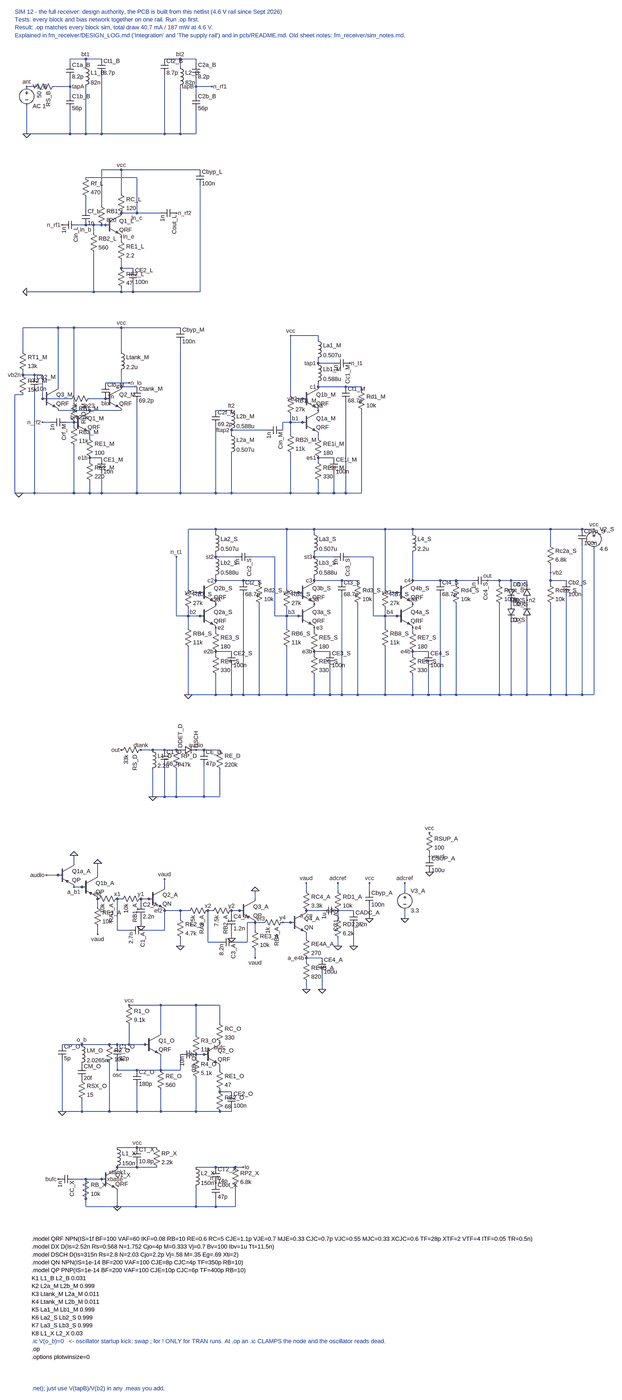
[diagram p0: schematic sim12_full_receiver.asc, whole sheet]
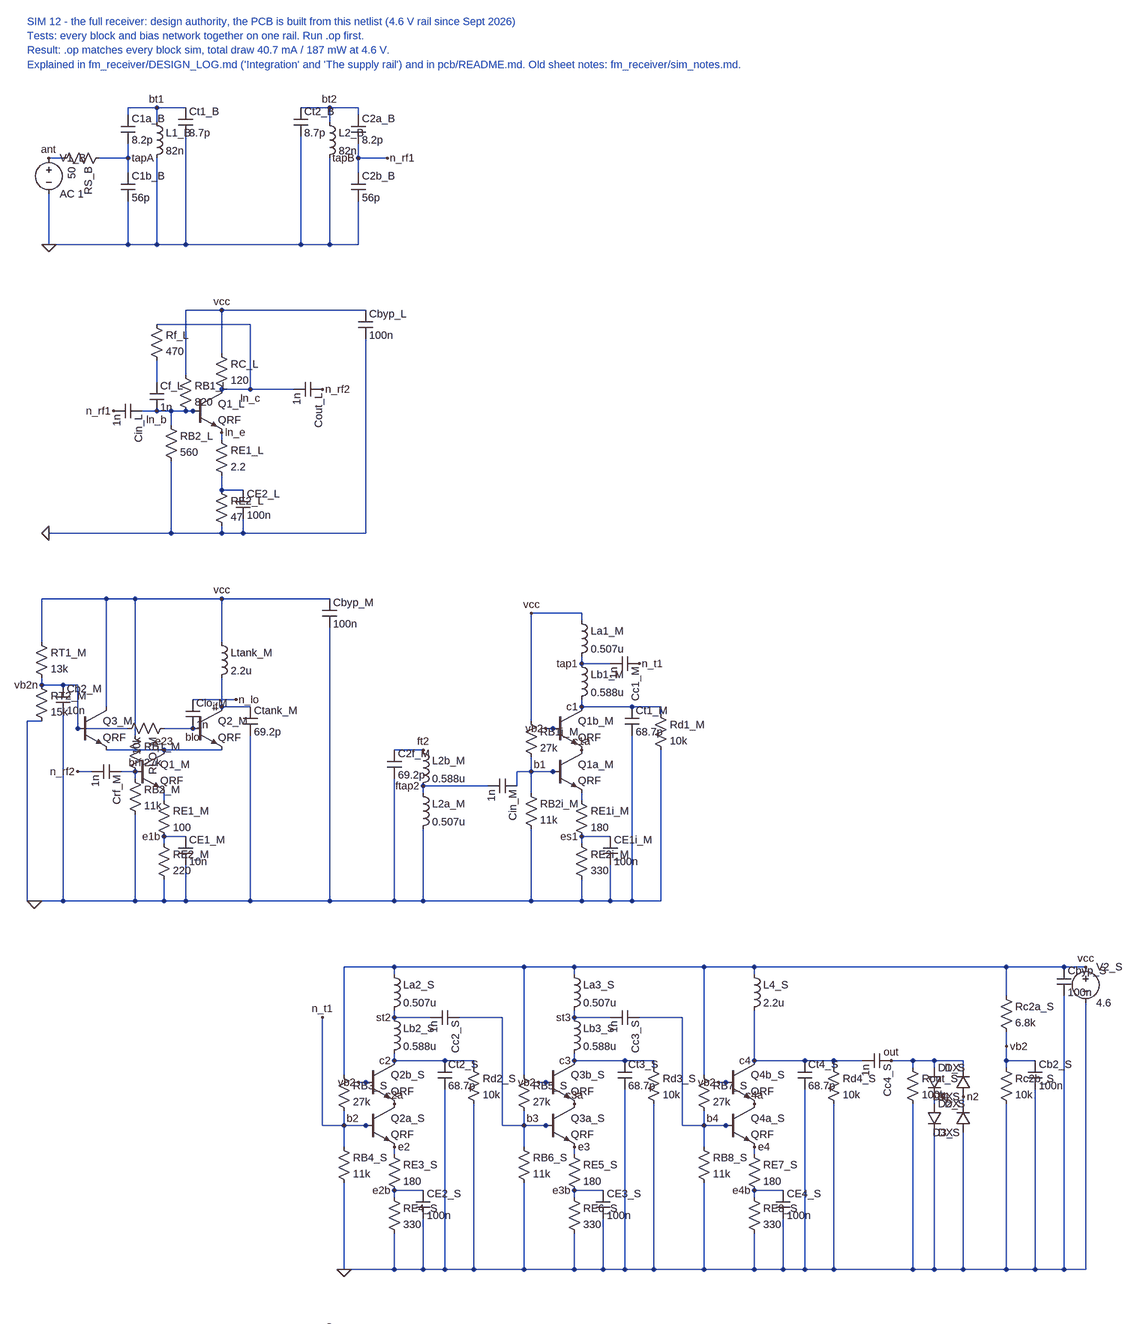
[diagram p1: schematic sim12_full_receiver.asc, part, row 1 of 2, column 1 of 1]
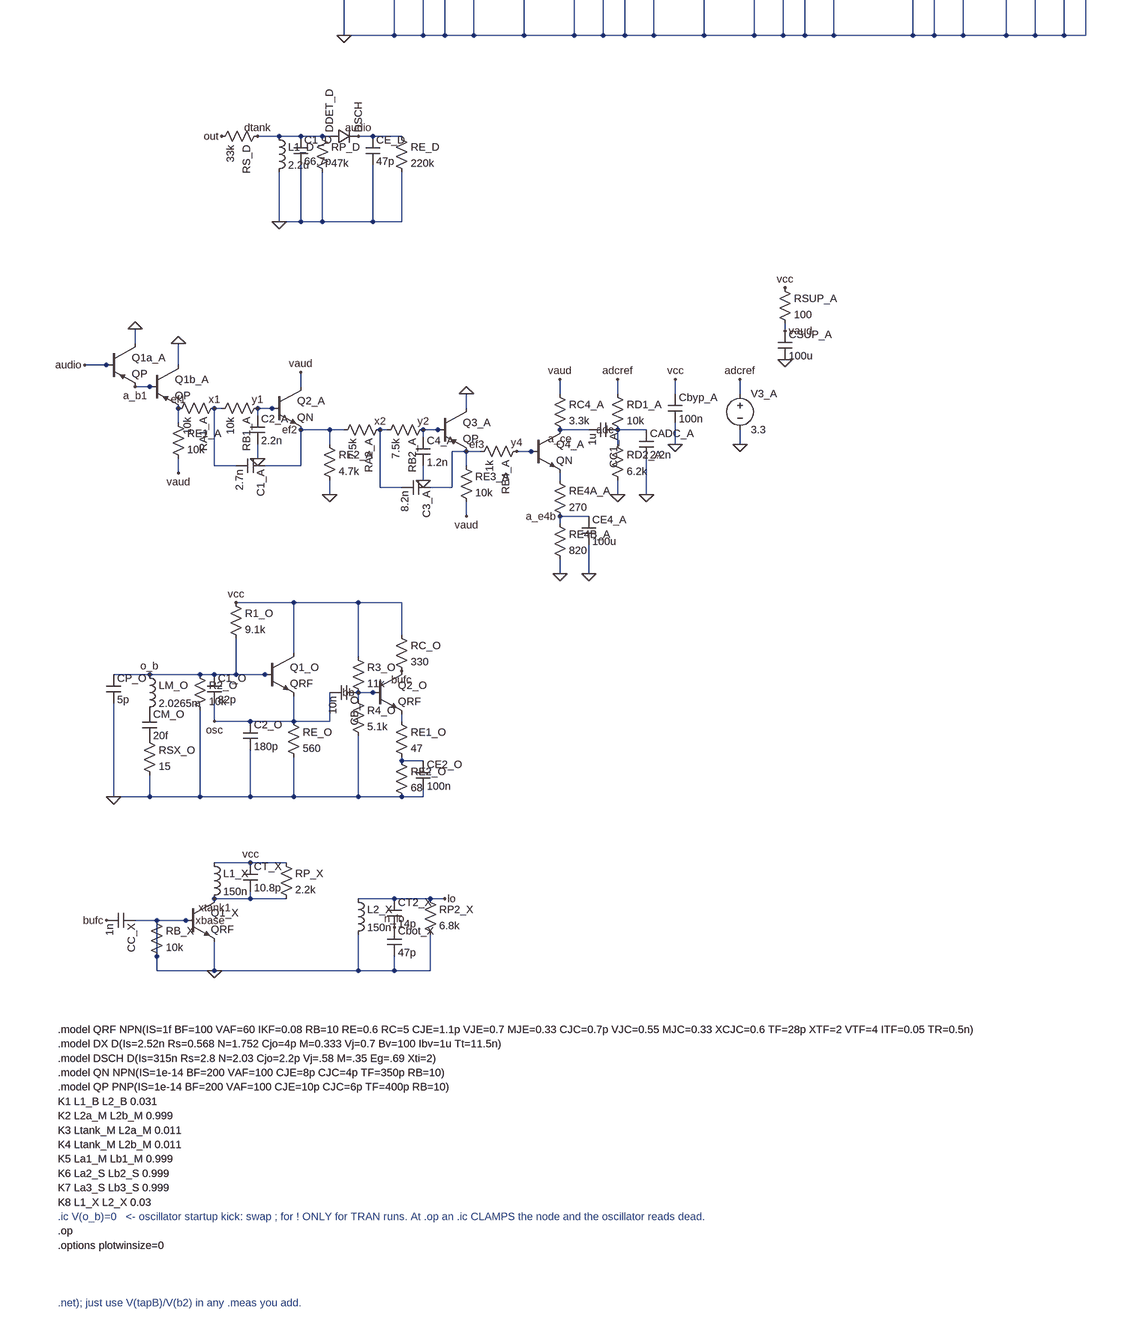
[diagram p2: schematic sim12_full_receiver.asc, part, row 2 of 2, column 1 of 1]
sim12_full_receiver.asc, the LTspice schematic file:
Version 4
SHEET 1 4000 7400
WIRE 80 208 112 208
WIRE 192 208 256 208
WIRE 80 288 80 400
WIRE 256 96 320 96
WIRE 320 96 384 96
WIRE 256 96 256 112
WIRE 256 176 256 240
WIRE 256 304 256 400
WIRE 320 96 320 128
WIRE 320 208 320 400
WIRE 384 160 384 400
WIRE 640 96 704 96
WIRE 704 96 768 96
WIRE 640 160 640 400
WIRE 704 96 704 128
WIRE 704 208 704 400
WIRE 768 96 768 112
WIRE 768 176 768 240
WIRE 768 304 768 400
WIRE 768 208 832 208
WIRE 80 400 256 400
WIRE 256 400 320 400
WIRE 320 400 384 400
WIRE 384 400 640 400
WIRE 640 400 704 400
WIRE 704 400 768 400
FLAG 80 400 0
FLAG 80 208 ant
FLAG 256 208 tapA
FLAG 320 96 bt1
FLAG 704 96 bt2
FLAG 768 208 tapB
FLAG 832 208 n_rf1
SYMBOL voltage 80 192 R0
SYMATTR InstName V1_B
SYMATTR Value AC 1
SYMBOL res 208 192 R90
SYMATTR InstName RS_B
SYMATTR Value 50
SYMBOL cap 240 112 R0
SYMATTR InstName C1a_B
SYMATTR Value 8.2p
SYMBOL cap 240 240 R0
SYMATTR InstName C1b_B
SYMATTR Value 56p
SYMBOL ind 304 112 R0
SYMATTR InstName L1_B
SYMATTR Value 82n
SYMATTR SpiceLine Rser=0.47
SYMBOL cap 368 96 R0
SYMATTR InstName Ct1_B
SYMATTR Value 8.7p
SYMBOL cap 624 96 R0
SYMATTR InstName Ct2_B
SYMATTR Value 8.7p
SYMBOL ind 688 112 R0
SYMATTR InstName L2_B
SYMATTR Value 82n
SYMATTR SpiceLine Rser=0.47
SYMBOL cap 752 112 R0
SYMATTR InstName C2a_B
SYMATTR Value 8.2p
SYMBOL cap 752 240 R0
SYMATTR InstName C2b_B
SYMATTR Value 56p
WIRE 288 1040 320 1040
WIRE 320 1040 352 1040
WIRE 352 1040 384 1040
WIRE 384 1040 416 1040
WIRE 320 928 320 976
WIRE 320 848 528 848
WIRE 352 1040 352 1072
WIRE 352 1152 352 1312
WIRE 384 816 384 960
WIRE 464 912 464 816
WIRE 464 992 528 992
WIRE 528 848 528 992
WIRE 528 992 624 992
WIRE 464 1088 464 1104
WIRE 464 1184 464 1216
WIRE 464 1216 512 1216
WIRE 512 1280 512 1312
WIRE 464 1296 464 1312
WIRE 384 816 464 816
WIRE 464 816 784 816
WIRE 784 880 784 1312
WIRE 80 1312 352 1312
WIRE 352 1312 464 1312
WIRE 464 1312 512 1312
WIRE 512 1312 688 1312
WIRE 688 1312 784 1312
FLAG 80 1312 0
FLAG 464 816 vcc
FLAG 224 1040 n_rf1
FLAG 320 1040 ln_b
FLAG 528 992 ln_c
FLAG 688 992 n_rf2
FLAG 464 1088 ln_e
SYMBOL cap 288 1024 R90
SYMATTR InstName Cin_L
SYMATTR Value 1n
SYMBOL res 304 832 R0
SYMATTR InstName Rf_L
SYMATTR Value 470
SYMBOL cap 304 976 R0
SYMATTR InstName Cf_L
SYMATTR Value 1n
SYMBOL res 368 944 R0
SYMATTR InstName RB1_L
SYMATTR Value 820
SYMBOL res 336 1056 R0
SYMATTR InstName RB2_L
SYMATTR Value 560
SYMBOL npn 400 992 R0
SYMATTR InstName Q1_L
SYMATTR Value QRF
SYMBOL res 448 896 R0
SYMATTR InstName RC_L
SYMATTR Value 120
SYMBOL res 448 1088 R0
SYMATTR InstName RE1_L
SYMATTR Value 2.2
SYMBOL res 448 1200 R0
SYMATTR InstName RE2_L
SYMATTR Value 47
SYMBOL cap 496 1216 R0
SYMATTR InstName CE2_L
SYMATTR Value 100n
SYMBOL cap 688 976 R90
SYMATTR InstName Cout_L
SYMATTR Value 1n
SYMBOL cap 768 816 R0
SYMATTR InstName Cbyp_L
SYMATTR Value 100n
WIRE 64 1616 208 1616
WIRE 208 1616 272 1616
WIRE 272 1616 464 1616
WIRE 464 1616 704 1616
WIRE 64 1712 64 1616
WIRE 208 1856 208 1616
WIRE 272 1920 272 1616
WIRE 464 1712 464 1616
WIRE 64 1792 64 1808
WIRE 64 1888 32 1888
WIRE 32 1888 32 2288
WIRE 32 2288 48 2288
WIRE 64 1808 112 1808
WIRE 112 1808 144 1808
WIRE 144 1808 144 1904
WIRE 112 1872 112 2288
WIRE 144 1904 256 1904
WIRE 336 1904 400 1904
WIRE 400 1840 496 1840
WIRE 464 1792 464 1856
WIRE 464 1856 528 1856
WIRE 528 1920 528 2288
WIRE 208 1952 336 1952
WIRE 336 1952 464 1952
WIRE 144 2000 176 2000
WIRE 240 2000 272 2000
WIRE 272 2000 272 2016
WIRE 272 2096 272 2288
WIRE 336 2048 336 2064
WIRE 336 2144 336 2160
WIRE 336 2144 384 2144
WIRE 336 2240 336 2288
WIRE 384 2208 384 2288
WIRE 48 2288 112 2288
WIRE 112 2288 272 2288
WIRE 272 2288 336 2288
WIRE 336 2288 384 2288
WIRE 384 2288 528 2288
WIRE 528 2288 640 2288
WIRE 640 2288 704 2288
WIRE 704 1680 704 2288
WIRE 704 2288 768 2288
WIRE 848 1952 912 1952
WIRE 848 2016 848 2288
WIRE 912 2032 912 2048
WIRE 912 2032 1056 2032
WIRE 912 2128 912 2288
WIRE 1120 2000 1120 2032
WIRE 1120 2000 1152 2000
WIRE 1152 1648 1264 1648
WIRE 1152 1648 1152 1888
WIRE 1264 1648 1264 1664
WIRE 1264 1744 1264 1760
WIRE 1264 1840 1264 1856
WIRE 1264 1856 1376 1856
WIRE 1376 1856 1440 1856
WIRE 1440 1856 1440 1872
WIRE 1440 1952 1440 2288
WIRE 1376 1920 1376 2288
WIRE 1152 1968 1152 2048
WIRE 1152 2000 1216 2000
WIRE 1184 1904 1216 1904
WIRE 1152 2128 1152 2288
WIRE 1264 2048 1264 2064
WIRE 1264 2144 1264 2160
WIRE 1264 2144 1328 2144
WIRE 1264 2240 1264 2288
WIRE 1328 2208 1328 2288
WIRE 768 2288 848 2288
WIRE 848 2288 912 2288
WIRE 912 2288 1152 2288
WIRE 1152 2288 1264 2288
WIRE 1264 2288 1328 2288
WIRE 1328 2288 1376 2288
WIRE 1376 2288 1440 2288
FLAG 48 2288 0
FLAG 464 1616 vcc
FLAG 1152 1648 vcc
FLAG 272 2000 brf
FLAG 64 1808 vb2n
FLAG 400 1904 blo
FLAG 336 1952 e23
FLAG 464 1856 if
FLAG 336 2144 e1b
FLAG 912 1952 ft2
FLAG 912 2032 ftap2
FLAG 1152 2000 b1
FLAG 1184 1904 vb2
FLAG 1264 1760 tap1
FLAG 1264 1856 c1
FLAG 1264 1952 c1a
FLAG 1264 2144 es1
SYMBOL cap 240 1984 R90
SYMATTR InstName Crf_M
SYMATTR Value 1n
SYMBOL res 256 1904 R0
SYMATTR InstName RB1_M
SYMATTR Value 27k
SYMBOL res 256 2000 R0
SYMATTR InstName RB2_M
SYMATTR Value 11k
SYMBOL npn 272 1952 R0
SYMATTR InstName Q1_M
SYMATTR Value QRF
SYMBOL res 320 2048 R0
SYMATTR InstName RE1_M
SYMATTR Value 100
SYMBOL res 320 2144 R0
SYMATTR InstName RE2_M
SYMATTR Value 220
SYMBOL cap 368 2144 R0
SYMATTR InstName CE1_M
SYMATTR Value 10n
SYMBOL res 48 1696 R0
SYMATTR InstName RT1_M
SYMATTR Value 13k
SYMBOL res 48 1792 R0
SYMATTR InstName RT2_M
SYMATTR Value 15k
SYMBOL cap 96 1808 R0
SYMATTR InstName Cb2_M
SYMATTR Value 10n
SYMBOL npn 144 1856 R0
SYMATTR InstName Q3_M
SYMATTR Value QRF
SYMBOL npn 400 1856 R0
SYMATTR InstName Q2_M
SYMATTR Value QRF
SYMBOL res 352 1888 R90
SYMATTR InstName RLO_M
SYMATTR Value 10k
SYMBOL cap 384 1840 R0
SYMATTR InstName Clo_M
SYMATTR Value 1n
SYMBOL ind 448 1696 R0
SYMATTR InstName Ltank_M
SYMATTR Value 2.2u
SYMATTR SpiceLine Rser=1
SYMBOL cap 512 1856 R0
SYMATTR InstName Ctank_M
SYMATTR Value 69.2p
SYMBOL cap 688 1616 R0
SYMATTR InstName Cbyp_M
SYMATTR Value 100n
SYMBOL cap 832 1952 R0
SYMATTR InstName C2f_M
SYMATTR Value 69.2p
SYMBOL ind 896 1936 R0
SYMATTR InstName L2b_M
SYMATTR Value 0.588u
SYMATTR SpiceLine Rser=0.5
SYMBOL ind 896 2032 R0
SYMATTR InstName L2a_M
SYMATTR Value 0.507u
SYMATTR SpiceLine Rser=0.5
SYMBOL cap 1120 2016 R90
SYMATTR InstName Cin_M
SYMATTR Value 1n
SYMBOL res 1136 1872 R0
SYMATTR InstName RB1i_M
SYMATTR Value 27k
SYMBOL res 1136 2032 R0
SYMATTR InstName RB2i_M
SYMATTR Value 11k
SYMBOL npn 1200 1856 R0
SYMATTR InstName Q1b_M
SYMATTR Value QRF
SYMBOL npn 1200 1952 R0
SYMATTR InstName Q1a_M
SYMATTR Value QRF
SYMBOL ind 1248 1648 R0
SYMATTR InstName La1_M
SYMATTR Value 0.507u
SYMBOL ind 1248 1744 R0
SYMATTR InstName Lb1_M
SYMATTR Value 0.588u
SYMBOL cap 1360 1856 R0
SYMATTR InstName Ct1_M
SYMATTR Value 68.7p
SYMBOL res 1424 1856 R0
SYMATTR InstName Rd1_M
SYMATTR Value 10k
SYMBOL res 1248 2048 R0
SYMATTR InstName RE1i_M
SYMATTR Value 180
SYMBOL res 1248 2144 R0
SYMATTR InstName RE2i_M
SYMATTR Value 330
SYMBOL cap 1312 2144 R0
SYMATTR InstName CE1i_M
SYMATTR Value 100n
SYMBOL cap 1392 1744 R90
SYMATTR InstName Cc1_M
SYMATTR Value 1n
WIRE 1264 1760 1328 1760
FLAG 1392 1760 n_t1
FLAG 144 2000 n_rf2
FLAG 496 1840 n_lo
WIRE 736 2448 848 2448
WIRE 848 2448 1136 2448
WIRE 1136 2448 1248 2448
WIRE 1248 2448 1536 2448
WIRE 1536 2448 1648 2448
WIRE 1648 2448 2208 2448
WIRE 2208 2448 2336 2448
WIRE 2336 2448 2384 2448
WIRE 736 2448 736 2688
WIRE 848 2448 848 2464
WIRE 1136 2448 1136 2688
WIRE 1248 2448 1248 2464
WIRE 1536 2448 1536 2688
WIRE 1648 2448 1648 2464
WIRE 2208 2448 2208 2512
WIRE 688 2560 688 2800
WIRE 688 2800 736 2800
WIRE 736 2768 736 2848
WIRE 736 2928 736 3120
WIRE 736 2800 800 2800
WIRE 768 2704 800 2704
WIRE 848 2544 848 2560
WIRE 848 2640 848 2656
WIRE 848 2656 960 2656
WIRE 960 2656 1024 2656
WIRE 1024 2656 1024 2672
WIRE 1024 2752 1024 3120
WIRE 960 2720 960 3120
WIRE 848 2848 848 2864
WIRE 848 2944 848 2960
WIRE 848 2944 912 2944
WIRE 848 3040 848 3120
WIRE 912 3008 912 3120
WIRE 848 2560 928 2560
WIRE 992 2560 1088 2560
WIRE 1088 2560 1088 2800
WIRE 1088 2800 1136 2800
WIRE 1136 2768 1136 2848
WIRE 1136 2928 1136 3120
WIRE 1136 2800 1200 2800
WIRE 1168 2704 1200 2704
WIRE 1248 2544 1248 2560
WIRE 1248 2640 1248 2656
WIRE 1248 2656 1360 2656
WIRE 1360 2656 1424 2656
WIRE 1424 2656 1424 2672
WIRE 1424 2752 1424 3120
WIRE 1360 2720 1360 3120
WIRE 1248 2848 1248 2864
WIRE 1248 2944 1248 2960
WIRE 1248 2944 1312 2944
WIRE 1248 3040 1248 3120
WIRE 1312 3008 1312 3120
WIRE 1248 2560 1328 2560
WIRE 1392 2560 1488 2560
WIRE 1488 2560 1488 2800
WIRE 1488 2800 1536 2800
WIRE 1536 2768 1536 2848
WIRE 1536 2928 1536 3120
WIRE 1536 2800 1600 2800
WIRE 1568 2704 1600 2704
WIRE 1648 2544 1648 2656
WIRE 1648 2656 1760 2656
WIRE 1760 2656 1824 2656
WIRE 1824 2656 1824 2672
WIRE 1824 2752 1824 3120
WIRE 1760 2720 1760 3120
WIRE 1648 2848 1648 2864
WIRE 1648 2944 1648 2960
WIRE 1648 2944 1712 2944
WIRE 1648 3040 1648 3120
WIRE 1712 3008 1712 3120
WIRE 1824 2656 1888 2656
WIRE 1952 2656 2000 2656
WIRE 2000 2656 2048 2656
WIRE 2048 2656 2112 2656
WIRE 2000 2656 2000 2672
WIRE 2000 2752 2000 3120
WIRE 2048 2656 2048 2672
WIRE 2048 2736 2048 2752
WIRE 2048 2816 2048 3120
WIRE 2112 2656 2112 2672
WIRE 2112 2752 2112 2736
WIRE 2112 2816 2112 3120
WIRE 2208 2592 2208 2672
WIRE 2208 2656 2272 2656
WIRE 2208 2752 2208 3120
WIRE 2272 2720 2272 3120
WIRE 2336 2512 2336 3120
WIRE 2384 2528 2384 3120
WIRE 736 3120 848 3120
WIRE 848 3120 912 3120
WIRE 912 3120 960 3120
WIRE 960 3120 1024 3120
WIRE 1024 3120 1136 3120
WIRE 1136 3120 1248 3120
WIRE 1248 3120 1312 3120
WIRE 1312 3120 1360 3120
WIRE 1360 3120 1424 3120
WIRE 1424 3120 1536 3120
WIRE 1536 3120 1648 3120
WIRE 1648 3120 1712 3120
WIRE 1712 3120 1760 3120
WIRE 1760 3120 1824 3120
WIRE 1824 3120 2000 3120
WIRE 2000 3120 2048 3120
WIRE 2048 3120 2112 3120
WIRE 2112 3120 2208 3120
WIRE 2208 3120 2272 3120
WIRE 2272 3120 2336 3120
WIRE 2336 3120 2384 3120
FLAG 2384 2448 vcc
FLAG 736 2800 b2
FLAG 848 2560 st2
FLAG 848 2656 c2
FLAG 848 2752 c2a
FLAG 848 2848 e2
FLAG 848 2944 e2b
FLAG 768 2704 vb2
FLAG 1136 2800 b3
FLAG 1248 2560 st3
FLAG 1248 2656 c3
FLAG 1248 2752 c3a
FLAG 1248 2848 e3
FLAG 1248 2944 e3b
FLAG 1168 2704 vb2
FLAG 1536 2800 b4
FLAG 1648 2656 c4
FLAG 1648 2752 c4a
FLAG 1648 2848 e4
FLAG 1648 2944 e4b
FLAG 1568 2704 vb2
FLAG 1952 2656 out
FLAG 2048 2736 n1
FLAG 2112 2736 n2
FLAG 2208 2624 vb2
SYMBOL res 720 2672 R0
SYMATTR InstName RB3_S
SYMATTR Value 27k
SYMBOL res 720 2832 R0
SYMATTR InstName RB4_S
SYMATTR Value 11k
SYMBOL npn 784 2656 R0
SYMATTR InstName Q2b_S
SYMATTR Value QRF
SYMBOL npn 784 2752 R0
SYMATTR InstName Q2a_S
SYMATTR Value QRF
SYMBOL ind 832 2448 R0
SYMATTR InstName La2_S
SYMATTR Value 0.507u
SYMBOL ind 832 2544 R0
SYMATTR InstName Lb2_S
SYMATTR Value 0.588u
SYMBOL cap 944 2656 R0
SYMATTR InstName Ct2_S
SYMATTR Value 68.7p
SYMBOL res 1008 2656 R0
SYMATTR InstName Rd2_S
SYMATTR Value 10k
SYMBOL res 832 2848 R0
SYMATTR InstName RE3_S
SYMATTR Value 180
SYMBOL res 832 2944 R0
SYMATTR InstName RE4_S
SYMATTR Value 330
SYMBOL cap 896 2944 R0
SYMATTR InstName CE2_S
SYMATTR Value 100n
SYMBOL cap 992 2544 R90
SYMATTR InstName Cc2_S
SYMATTR Value 1n
SYMBOL res 1120 2672 R0
SYMATTR InstName RB5_S
SYMATTR Value 27k
SYMBOL res 1120 2832 R0
SYMATTR InstName RB6_S
SYMATTR Value 11k
SYMBOL npn 1184 2656 R0
SYMATTR InstName Q3b_S
SYMATTR Value QRF
SYMBOL npn 1184 2752 R0
SYMATTR InstName Q3a_S
SYMATTR Value QRF
SYMBOL ind 1232 2448 R0
SYMATTR InstName La3_S
SYMATTR Value 0.507u
SYMBOL ind 1232 2544 R0
SYMATTR InstName Lb3_S
SYMATTR Value 0.588u
SYMBOL cap 1344 2656 R0
SYMATTR InstName Ct3_S
SYMATTR Value 68.7p
SYMBOL res 1408 2656 R0
SYMATTR InstName Rd3_S
SYMATTR Value 10k
SYMBOL res 1232 2848 R0
SYMATTR InstName RE5_S
SYMATTR Value 180
SYMBOL res 1232 2944 R0
SYMATTR InstName RE6_S
SYMATTR Value 330
SYMBOL cap 1296 2944 R0
SYMATTR InstName CE3_S
SYMATTR Value 100n
SYMBOL cap 1392 2544 R90
SYMATTR InstName Cc3_S
SYMATTR Value 1n
SYMBOL res 1520 2672 R0
SYMATTR InstName RB7_S
SYMATTR Value 27k
SYMBOL res 1520 2832 R0
SYMATTR InstName RB8_S
SYMATTR Value 11k
SYMBOL npn 1584 2656 R0
SYMATTR InstName Q4b_S
SYMATTR Value QRF
SYMBOL npn 1584 2752 R0
SYMATTR InstName Q4a_S
SYMATTR Value QRF
SYMBOL ind 1632 2448 R0
SYMATTR InstName L4_S
SYMATTR Value 2.2u
SYMBOL cap 1744 2656 R0
SYMATTR InstName Ct4_S
SYMATTR Value 68.7p
SYMBOL res 1808 2656 R0
SYMATTR InstName Rd4_S
SYMATTR Value 10k
SYMBOL res 1632 2848 R0
SYMATTR InstName RE7_S
SYMATTR Value 180
SYMBOL res 1632 2944 R0
SYMATTR InstName RE8_S
SYMATTR Value 330
SYMBOL cap 1696 2944 R0
SYMATTR InstName CE4_S
SYMATTR Value 100n
SYMBOL cap 1952 2640 R90
SYMATTR InstName Cc4_S
SYMATTR Value 1n
SYMBOL res 1984 2656 R0
SYMATTR InstName Rout_S
SYMATTR Value 100k
SYMBOL diode 2032 2672 R0
SYMATTR InstName D1_S
SYMATTR Value DX
SYMBOL diode 2032 2752 R0
SYMATTR InstName D2_S
SYMATTR Value DX
SYMBOL diode 2128 2736 R180
SYMATTR InstName D4_S
SYMATTR Value DX
SYMBOL diode 2128 2816 R180
SYMATTR InstName D3_S
SYMATTR Value DX
SYMBOL res 2192 2496 R0
SYMATTR InstName Rc2a_S
SYMATTR Value 6.8k
SYMBOL res 2192 2656 R0
SYMATTR InstName Rc2b_S
SYMATTR Value 10k
SYMBOL cap 2256 2656 R0
SYMATTR InstName Cb2_S
SYMATTR Value 100n
SYMBOL cap 2320 2448 R0
SYMATTR InstName Cbyp_S
SYMATTR Value 100n
SYMBOL voltage 2384 2432 R0
SYMATTR InstName V2_S
SYMATTR Value 4.6
FLAG 688 2560 n_t1
FLAG 736 3120 0
WIRE 544 3396 704 3396
WIRE 592 3476 592 3636
WIRE 640 3460 640 3636
WIRE 688 3476 688 3636
WIRE 768 3396 864 3396
WIRE 800 3460 800 3636
WIRE 864 3476 864 3636
WIRE 592 3636 640 3636
WIRE 640 3636 688 3636
WIRE 688 3636 800 3636
WIRE 800 3636 864 3636
FLAG 544 3396 dtank
FLAG 768 3396 audio
SYMBOL res 560 3380 R90
SYMATTR InstName RS_D
SYMATTR Value 33k
SYMBOL ind 576 3380 R0
SYMATTR InstName L1_D
SYMATTR Value 2.2u
SYMBOL cap 624 3396 R0
SYMATTR InstName C1_D
SYMATTR Value 66.7p
SYMBOL res 672 3380 R0
SYMATTR InstName RP_D
SYMATTR Value 47k
SYMBOL diode 704 3412 R270
SYMATTR InstName DDET_D
SYMATTR Value DSCH
SYMBOL cap 784 3396 R0
SYMATTR InstName CE_D
SYMATTR Value 47p
SYMBOL res 848 3380 R0
SYMATTR InstName RE_D
SYMATTR Value 220k
FLAG 464 3396 out
FLAG 592 3636 0
WIRE 160 4388 224 4388
WIRE 272 4340 272 4308
WIRE 272 4436 320 4436
WIRE 368 4388 368 4340
WIRE 368 4484 368 4516
WIRE 368 4596 368 4628
WIRE 448 4484 464 4484
WIRE 544 4484 544 4500
WIRE 544 4564 544 4596
WIRE 544 4484 592 4484
WIRE 640 4436 640 4404
WIRE 640 4532 704 4532
WIRE 704 4532 704 4564
WIRE 704 4644 704 4676
WIRE 448 4484 448 4612
WIRE 448 4612 496 4612
WIRE 560 4612 640 4612
WIRE 640 4612 640 4532
WIRE 704 4532 736 4532
WIRE 816 4532 832 4532
WIRE 912 4532 912 4548
WIRE 912 4612 912 4644
WIRE 912 4532 960 4532
WIRE 1008 4484 1008 4452
WIRE 1008 4580 1008 4612
WIRE 1008 4692 1008 4724
WIRE 816 4532 816 4660
WIRE 816 4660 864 4660
WIRE 928 4660 976 4660
WIRE 976 4660 976 4580
WIRE 976 4580 1008 4580
WIRE 1008 4580 1040 4580
WIRE 1120 4580 1168 4580
WIRE 1216 4452 1216 4420
WIRE 1216 4628 1216 4644
WIRE 1216 4724 1216 4740
WIRE 1216 4820 1216 4852
WIRE 1216 4724 1280 4724
WIRE 1280 4788 1280 4852
WIRE 1216 4532 1280 4532
WIRE 1344 4452 1344 4420
WIRE 1344 4532 1344 4564
WIRE 1344 4644 1344 4676
WIRE 1344 4532 1408 4532
WIRE 1408 4596 1408 4676
WIRE 1472 4452 1472 4420
WIRE 1472 4516 1472 4564
WIRE 1616 4452 1616 4420
WIRE 1616 4532 1616 4564
FLAG 160 4388 audio
FLAG 272 4308 0
FLAG 272 4436 a_b1
FLAG 368 4340 0
FLAG 368 4484 ef1
FLAG 368 4628 vaud
FLAG 448 4484 x1
FLAG 544 4484 y1
FLAG 544 4596 0
FLAG 640 4404 vaud
FLAG 640 4532 ef2
FLAG 704 4676 0
FLAG 816 4532 x2
FLAG 912 4532 y2
FLAG 912 4644 0
FLAG 1008 4452 0
FLAG 1008 4580 ef3
FLAG 1008 4724 vaud
FLAG 1120 4580 y4
FLAG 1216 4420 vaud
FLAG 1216 4532 a_ce
FLAG 1216 4724 a_e4b
FLAG 1216 4852 0
FLAG 1280 4852 0
FLAG 1344 4420 adcref
FLAG 1344 4532 adc
FLAG 1344 4676 0
FLAG 1408 4676 0
FLAG 1472 4420 vcc
FLAG 1472 4564 0
FLAG 1616 4420 adcref
FLAG 1616 4564 0
SYMBOL pnp 208 4340 R0
SYMATTR InstName Q1a_A
SYMATTR Value QP
SYMBOL pnp 304 4388 R0
SYMATTR InstName Q1b_A
SYMATTR Value QP
SYMBOL res 352 4500 R0
SYMATTR InstName RE1_A
SYMATTR Value 10k
SYMBOL res 464 4468 R90
SYMATTR InstName RA1_A
SYMATTR Value 10k
SYMBOL res 560 4468 R90
SYMATTR InstName RB1_A
SYMATTR Value 10k
SYMBOL cap 528 4500 R0
SYMATTR InstName C2_A
SYMATTR Value 2.2n
SYMBOL npn 576 4436 R0
SYMATTR InstName Q2_A
SYMATTR Value QN
SYMBOL res 688 4548 R0
SYMATTR InstName RE2_A
SYMATTR Value 4.7k
SYMBOL cap 560 4596 R90
SYMATTR InstName C1_A
SYMATTR Value 2.7n
SYMBOL res 832 4516 R90
SYMATTR InstName RA2_A
SYMATTR Value 7.5k
SYMBOL res 928 4516 R90
SYMATTR InstName RB2_A
SYMATTR Value 7.5k
SYMBOL cap 896 4548 R0
SYMATTR InstName C4_A
SYMATTR Value 1.2n
SYMBOL pnp 944 4484 R0
SYMATTR InstName Q3_A
SYMATTR Value QP
SYMBOL res 992 4596 R0
SYMATTR InstName RE3_A
SYMATTR Value 10k
SYMBOL cap 928 4644 R90
SYMATTR InstName C3_A
SYMATTR Value 8.2n
SYMBOL res 1136 4564 R90
SYMATTR InstName RB4_A
SYMATTR Value 1k
SYMBOL npn 1152 4532 R0
SYMATTR InstName Q4_A
SYMATTR Value QN
SYMBOL res 1200 4436 R0
SYMATTR InstName RC4_A
SYMATTR Value 3.3k
SYMBOL res 1200 4628 R0
SYMATTR InstName RE4A_A
SYMATTR Value 270
SYMBOL res 1200 4724 R0
SYMATTR InstName RE4B_A
SYMATTR Value 820
SYMBOL cap 1264 4724 R0
SYMATTR InstName CE4_A
SYMATTR Value 100u
SYMBOL cap 1344 4516 R90
SYMATTR InstName CC1_A
SYMATTR Value 1u
SYMBOL res 1328 4436 R0
SYMATTR InstName RD1_A
SYMATTR Value 10k
SYMBOL res 1328 4548 R0
SYMATTR InstName RD2_A
SYMATTR Value 6.2k
SYMBOL cap 1392 4532 R0
SYMATTR InstName CADC_A
SYMATTR Value 2.2n
SYMBOL cap 1456 4452 R0
SYMATTR InstName Cbyp_A
SYMATTR Value 100n
SYMBOL voltage 1616 4436 R0
SYMATTR InstName V3_A
SYMATTR Value 3.3
SYMBOL res 1700 4200 R0
SYMATTR InstName RSUP_A
SYMATTR Value 100
SYMBOL cap 1700 4312 R0
SYMATTR InstName CSUP_A
SYMATTR Value 100u
WIRE 1716 4296 1716 4312
FLAG 1716 4216 vcc
FLAG 1716 4312 vaud
FLAG 1716 4376 0
WIRE 304 5076 224 5076
WIRE 416 5076 304 5076
WIRE 448 5076 416 5076
WIRE 496 5076 448 5076
WIRE 576 5076 496 5076
WIRE 624 5028 624 4916
WIRE 496 4916 624 4916
WIRE 624 4916 768 4916
WIRE 768 4916 864 4916
WIRE 496 4996 496 5076
WIRE 448 5140 448 5180
WIRE 528 5180 448 5180
WIRE 624 5180 528 5180
WIRE 624 5124 624 5180
WIRE 624 5180 704 5180
WIRE 704 5180 704 5116
WIRE 768 5116 816 5116
WIRE 768 5116 768 5132
WIRE 768 5036 768 4916
WIRE 768 5212 768 5348
WIRE 864 4988 864 4916
WIRE 864 5164 864 5180
WIRE 864 5260 864 5268
WIRE 864 5268 912 5268
WIRE 912 5332 912 5348
WIRE 224 5140 224 5348
WIRE 304 5300 304 5348
WIRE 416 5156 416 5348
WIRE 528 5244 528 5348
WIRE 624 5260 624 5348
WIRE 304 5348 224 5348
WIRE 416 5348 304 5348
WIRE 528 5348 416 5348
WIRE 624 5348 528 5348
WIRE 768 5348 624 5348
WIRE 864 5348 768 5348
WIRE 912 5348 864 5348
FLAG 224 5348 0
FLAG 448 5180 osc
FLAG 304 5076 o_b
FLAG 768 5116 bb
FLAG 864 5068 bufc
SYMBOL res 480 4900 R0
SYMATTR InstName R1_O
SYMATTR Value 9.1k
SYMBOL res 400 5060 R0
SYMATTR InstName R2_O
SYMATTR Value 10k
SYMBOL npn 560 5028 R0
SYMATTR InstName Q1_O
SYMATTR Value QRF
SYMBOL ind 288 5060 R0
SYMATTR InstName LM_O
SYMATTR Value 2.0265m
SYMBOL cap 288 5156 R0
SYMATTR InstName CM_O
SYMATTR Value 20f
SYMBOL res 288 5204 R0
SYMATTR InstName RSX_O
SYMATTR Value 15
SYMBOL cap 208 5076 R0
SYMATTR InstName CP_O
SYMATTR Value 5p
SYMBOL cap 432 5076 R0
SYMATTR InstName C1_O
SYMATTR Value 82p
SYMBOL cap 512 5180 R0
SYMATTR InstName C2_O
SYMATTR Value 180p
SYMBOL res 608 5164 R0
SYMATTR InstName RE_O
SYMATTR Value 560
SYMBOL cap 768 5100 R90
SYMATTR InstName CB_O
SYMATTR Value 10n
SYMBOL res 752 5020 R0
SYMATTR InstName R3_O
SYMATTR Value 11k
SYMBOL res 752 5116 R0
SYMATTR InstName R4_O
SYMATTR Value 5.1k
SYMBOL npn 800 5068 R0
SYMATTR InstName Q2_O
SYMATTR Value QRF
SYMBOL res 848 4972 R0
SYMATTR InstName RC_O
SYMATTR Value 330
SYMBOL res 848 5164 R0
SYMATTR InstName RE1_O
SYMATTR Value 47
SYMBOL res 848 5252 R0
SYMATTR InstName RE2_O
SYMATTR Value 68
SYMBOL cap 896 5268 R0
SYMATTR InstName CE2_O
SYMATTR Value 100n
FLAG 496 4916 vcc
WIRE 400 5844 272 5844
WIRE 320 5924 320 5844
WIRE 528 5716 448 5716
WIRE 608 5716 528 5716
WIRE 528 5796 448 5796
WIRE 608 5796 528 5796
WIRE 528 5796 528 5780
WIRE 848 5796 768 5796
WIRE 928 5796 848 5796
WIRE 960 5796 928 5796
WIRE 448 5956 448 5892
WIRE 320 5956 320 5924
WIRE 448 5956 320 5956
WIRE 768 5956 768 5876
WIRE 768 5956 448 5956
WIRE 848 5956 768 5956
WIRE 928 5956 928 5876
WIRE 928 5956 848 5956
FLAG 400 5844 xbase
FLAG 448 5796 xtank1
FLAG 960 5796 lo
SYMBOL cap 272 5828 R90
SYMATTR InstName CC_X
SYMATTR Value 1n
SYMBOL res 304 5828 R0
SYMATTR InstName RB_X
SYMATTR Value 10k
SYMBOL npn 384 5796 R0
SYMATTR InstName Q1_X
SYMATTR Value QRF
SYMBOL ind 432 5700 R0
SYMATTR InstName L1_X
SYMATTR Value 150n
SYMBOL cap 512 5716 R0
SYMATTR InstName CT_X
SYMATTR Value 10.8p
SYMBOL res 592 5700 R0
SYMATTR InstName RP_X
SYMATTR Value 2.2k
SYMBOL ind 752 5780 R0
SYMATTR InstName L2_X
SYMATTR Value 150n
SYMBOL cap 832 5796 R0
SYMATTR InstName CT2_X
SYMATTR Value 14p
SYMBOL res 912 5780 R0
SYMATTR InstName RP2_X
SYMATTR Value 6.8k
SYMBOL cap 832 5860 R0
SYMATTR InstName Cbot_X
SYMATTR Value 47p
WIRE 848 5924 848 5956
FLAG 848 5860 n_lo
FLAG 208 5844 bufc
FLAG 448 5956 0
FLAG 528 5716 vcc
TEXT 100 6500 Left 2 !.model QRF NPN(IS=1f BF=100 VAF=60 IKF=0.08 RB=10 RE=0.6 RC=5 CJE=1.1p VJE=0.7 MJE=0.33 CJC=0.7p VJC=0.55 MJC=0.33 XCJC=0.6 TF=28p XTF=2 VTF=4 ITF=0.05 TR=0.5n)
TEXT 100 6532 Left 2 !.model DX D(Is=2.52n Rs=0.568 N=1.752 Cjo=4p M=0.333 Vj=0.7 Bv=100 Ibv=1u Tt=11.5n)
TEXT 100 6564 Left 2 !.model DSCH D(Is=315n Rs=2.8 N=2.03 Cjo=2.2p Vj=.58 M=.35 Eg=.69 Xti=2)
TEXT 100 6596 Left 2 !.model QN NPN(IS=1e-14 BF=200 VAF=100 CJE=8p CJC=4p TF=350p RB=10)
TEXT 100 6628 Left 2 !.model QP PNP(IS=1e-14 BF=200 VAF=100 CJE=10p CJC=6p TF=400p RB=10)
TEXT 100 6660 Left 2 !K1 L1_B L2_B 0.031
TEXT 100 6692 Left 2 !K2 L2a_M L2b_M 0.999
TEXT 100 6724 Left 2 !K3 Ltank_M L2a_M 0.011
TEXT 100 6756 Left 2 !K4 Ltank_M L2b_M 0.011
TEXT 100 6788 Left 2 !K5 La1_M Lb1_M 0.999
TEXT 100 6820 Left 2 !K6 La2_S Lb2_S 0.999
TEXT 100 6852 Left 2 !K7 La3_S Lb3_S 0.999
TEXT 100 6884 Left 2 !K8 L1_X L2_X 0.03
TEXT 100 6916 Left 2 ;.ic V(o_b)=0   <- oscillator startup kick: swap ; for ! ONLY for TRAN runs. At .op an .ic CLAMPS the node and the oscillator reads dead.
TEXT 100 6948 Left 2 !.op
TEXT 100 6980 Left 2 !.options plotwinsize=0
TEXT 100 8156 Left 2 ;.net); just use V(tapB)/V(b2) in any .meas you add.
TEXT 32 -96 Left 2 ;SIM 12 - the full receiver: design authority, the PCB is built from this netlist (4.6 V rail since Sept 2026)
TEXT 32 -64 Left 2 ;Tests: every block and bias network together on one rail. Run .op first.
TEXT 32 -32 Left 2 ;Result: .op matches every block sim, total draw 40.7 mA / 187 mW at 4.6 V.
TEXT 32 0 Left 2 ;Explained in fm_receiver/DESIGN_LOG.md ('Integration' and 'The supply rail') and in pcb/README.md. Old sheet notes: fm_receiver/sim_notes.md.

The netlist it stands for:
* sim12_full_receiver.asc
V1_B ant 0 AC 1
RS_B tapA ant 50
C1a_B bt1 tapA 8.2p
C1b_B tapA 0 56p
L1_B bt1 0 82n Rser=0.47
Ct1_B bt1 0 8.7p
Ct2_B bt2 0 8.7p
L2_B bt2 0 82n Rser=0.47
C2a_B bt2 n_rf1 8.2p
C2b_B n_rf1 0 56p
Cin_L ln_b n_rf1 1n
Rf_L ln_c N001 470
Cf_L N001 ln_b 1n
RB1_L vcc ln_b 820
RB2_L ln_b 0 560
Q1_L ln_c ln_b ln_e 0 QRF
RC_L vcc ln_c 120
RE1_L ln_e N002 2.2
RE2_L N002 0 47
CE2_L N002 0 100n
Cout_L n_rf2 ln_c 1n
Cbyp_L vcc 0 100n
Crf_M brf n_rf2 1n
RB1_M vcc brf 27k
RB2_M brf 0 11k
Q1_M e23 brf N003 0 QRF
RE1_M N003 e1b 100
RE2_M e1b 0 220
CE1_M e1b 0 10n
RT1_M vcc vb2n 13k
RT2_M vb2n 0 15k
Cb2_M vb2n 0 10n
Q3_M vcc vb2n e23 0 QRF
Q2_M if blo e23 0 QRF
RLO_M blo vb2n 10k
Clo_M n_lo blo 1n
Ltank_M vcc if 2.2u Rser=1
Ctank_M if 0 69.2p
Cbyp_M vcc 0 100n
C2f_M ft2 0 69.2p
L2b_M ft2 ftap2 0.588u Rser=0.5
L2a_M ftap2 0 0.507u Rser=0.5
Cin_M b1 ftap2 1n
RB1i_M vcc b1 27k
RB2i_M b1 0 11k
Q1b_M c1 vb2 c1a 0 QRF
Q1a_M c1a b1 N004 0 QRF
La1_M vcc tap1 0.507u
Lb1_M tap1 c1 0.588u
Ct1_M c1 0 68.7p
Rd1_M c1 0 10k
RE1i_M N004 es1 180
RE2i_M es1 0 330
CE1i_M es1 0 100n
Cc1_M b2 tap1 1n
RB3_S vcc b2 27k
RB4_S b2 0 11k
Q2b_S c2 vb2 c2a 0 QRF
Q2a_S c2a b2 e2 0 QRF
La2_S vcc st2 0.507u
Lb2_S st2 c2 0.588u
Ct2_S c2 0 68.7p
Rd2_S c2 0 10k
RE3_S e2 e2b 180
RE4_S e2b 0 330
CE2_S e2b 0 100n
Cc2_S b3 st2 1n
RB5_S vcc b3 27k
RB6_S b3 0 11k
Q3b_S c3 vb2 c3a 0 QRF
Q3a_S c3a b3 e3 0 QRF
La3_S vcc st3 0.507u
Lb3_S st3 c3 0.588u
Ct3_S c3 0 68.7p
Rd3_S c3 0 10k
RE5_S e3 e3b 180
RE6_S e3b 0 330
CE3_S e3b 0 100n
Cc3_S b4 st3 1n
RB7_S vcc b4 27k
RB8_S b4 0 11k
Q4b_S c4 vb2 c4a 0 QRF
Q4a_S c4a b4 e4 0 QRF
L4_S vcc c4 2.2u
Ct4_S c4 0 68.7p
Rd4_S c4 0 10k
RE7_S e4 e4b 180
RE8_S e4b 0 330
CE4_S e4b 0 100n
Cc4_S out c4 1n
Rout_S out 0 100k
D1_S out n1 DX
D2_S n1 0 DX
D4_S n2 out DX
D3_S 0 n2 DX
Rc2a_S vcc vb2 6.8k
Rc2b_S vb2 0 10k
Cb2_S vb2 0 100n
Cbyp_S vcc 0 100n
V2_S vcc 0 4.6
RS_D dtank out 33k
L1_D dtank 0 2.2u
C1_D dtank 0 66.7p
RP_D dtank 0 47k
DDET_D dtank audio DSCH
CE_D audio 0 47p
RE_D audio 0 220k
Q1a_A 0 audio a_b1 0 QP
Q1b_A 0 a_b1 ef1 0 QP
RE1_A ef1 vaud 10k
RA1_A x1 ef1 10k
RB1_A y1 x1 10k
C2_A y1 0 2.2n
Q2_A vaud y1 ef2 0 QN
RE2_A ef2 0 4.7k
C1_A ef2 x1 2.7n
RA2_A x2 ef2 7.5k
RB2_A y2 x2 7.5k
C4_A y2 0 1.2n
Q3_A 0 y2 ef3 0 QP
RE3_A ef3 vaud 10k
C3_A ef3 x2 8.2n
RB4_A y4 ef3 1k
Q4_A a_ce y4 N005 0 QN
RC4_A vaud a_ce 3.3k
RE4A_A N005 a_e4b 270
RE4B_A a_e4b 0 820
CE4_A a_e4b 0 100u
CC1_A adc a_ce 1u
RD1_A adcref adc 10k
RD2_A adc 0 6.2k
CADC_A adc 0 2.2n
Cbyp_A vcc 0 100n
V3_A adcref 0 3.3
RSUP_A vcc vaud 100
CSUP_A vaud 0 100u
R1_O vcc o_b 9.1k
R2_O o_b 0 10k
Q1_O vcc o_b osc 0 QRF
LM_O o_b P001 2.0265m
CM_O P001 P002 20f
RSX_O P002 0 15
CP_O o_b 0 5p
C1_O o_b osc 82p
C2_O osc 0 180p
RE_O osc 0 560
CB_O bb osc 10n
R3_O vcc bb 11k
R4_O bb 0 5.1k
Q2_O bufc bb N006 0 QRF
RC_O vcc bufc 330
RE1_O N006 N007 47
RE2_O N007 0 68
CE2_O N007 0 100n
CC_X 0 bufc 1n
RB_X 0 0 10k
Q1_X xtank1 0 0 0 QRF
L1_X vcc xtank1 150n
CT_X vcc xtank1 10.8p
RP_X vcc xtank1 2.2k
L2_X lo 0 150n
CT2_X lo n_lo 14p
RP2_X lo 0 6.8k
Cbot_X n_lo 0 47p
.model D D
.lib standard.dio
.model NPN NPN
.model PNP PNP
.lib standard.bjt
.model QRF NPN(IS=1f BF=100 VAF=60 IKF=0.08 RB=10 RE=0.6 RC=5 CJE=1.1p VJE=0.7 MJE=0.33 CJC=0.7p VJC=0.55 MJC=0.33 XCJC=0.6 TF=28p XTF=2 VTF=4 ITF=0.05 TR=0.5n)
.model DX D(Is=2.52n Rs=0.568 N=1.752 Cjo=4p M=0.333 Vj=0.7 Bv=100 Ibv=1u Tt=11.5n)
.model DSCH D(Is=315n Rs=2.8 N=2.03 Cjo=2.2p Vj=.58 M=.35 Eg=.69 Xti=2)
.model QN NPN(IS=1e-14 BF=200 VAF=100 CJE=8p CJC=4p TF=350p RB=10)
.model QP PNP(IS=1e-14 BF=200 VAF=100 CJE=10p CJC=6p TF=400p RB=10)
K1 L1_B L2_B 0.031
K2 L2a_M L2b_M 0.999
K3 Ltank_M L2a_M 0.011
K4 Ltank_M L2b_M 0.011
K5 La1_M Lb1_M 0.999
K6 La2_S Lb2_S 0.999
K7 La3_S Lb3_S 0.999
K8 L1_X L2_X 0.03
* .ic V(o_b)=0   <- oscillator startup kick: swap ; for ! ONLY for TRAN runs. At .op an .ic CLAMPS the node and the oscillator reads dead.
.op
.options plotwinsize=0
* .net); just use V(tapB)/V(b2) in any .meas you add.
* SIM 12 - the full receiver: design authority, the PCB is built from this netlist (4.6 V rail since Sept 2026)
* Tests: every block and bias network together on one rail. Run .op first.
* Result: .op matches every block sim, total draw 40.7 mA / 187 mW at 4.6 V.
* Explained in fm_receiver/DESIGN_LOG.md ('Integration' and 'The supply rail') and in pcb/README.md. Old sheet notes: fm_receiver/sim_notes.md.
.backanno
.end